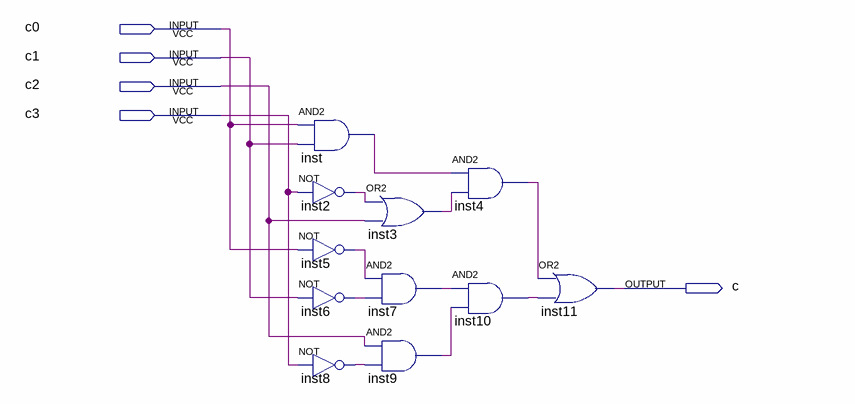
[diagram p0: schematic sheet]
// Quartus schematic c_segment.bdf as structural Verilog: 11 symbols, 5 pins
module c_segment (
  input  c0,
  input  c1,
  input  c2,
  input  c3,
  output c
);

  wire inst2_out, inst3_out, inst4_out, inst5_out, inst6_out, inst7_out, inst8_out, inst9_out, inst10_out,
       inst_out;

  and inst (inst_out, c0, c1);
  not inst2 (inst2_out, c3);
  not inst5 (inst5_out, c0);
  not inst6 (inst6_out, c1);
  not inst8 (inst8_out, c3);
  or inst3 (inst3_out, inst2_out, c2);
  and inst7 (inst7_out, inst5_out, inst6_out);
  and inst9 (inst9_out, c2, inst8_out);
  and inst4 (inst4_out, inst_out, inst3_out);
  and inst10 (inst10_out, inst7_out, inst9_out);
  or inst11 (c, inst4_out, inst10_out);
endmodule
